# EAGLE design Stingray (EAGLE 6.5.0)
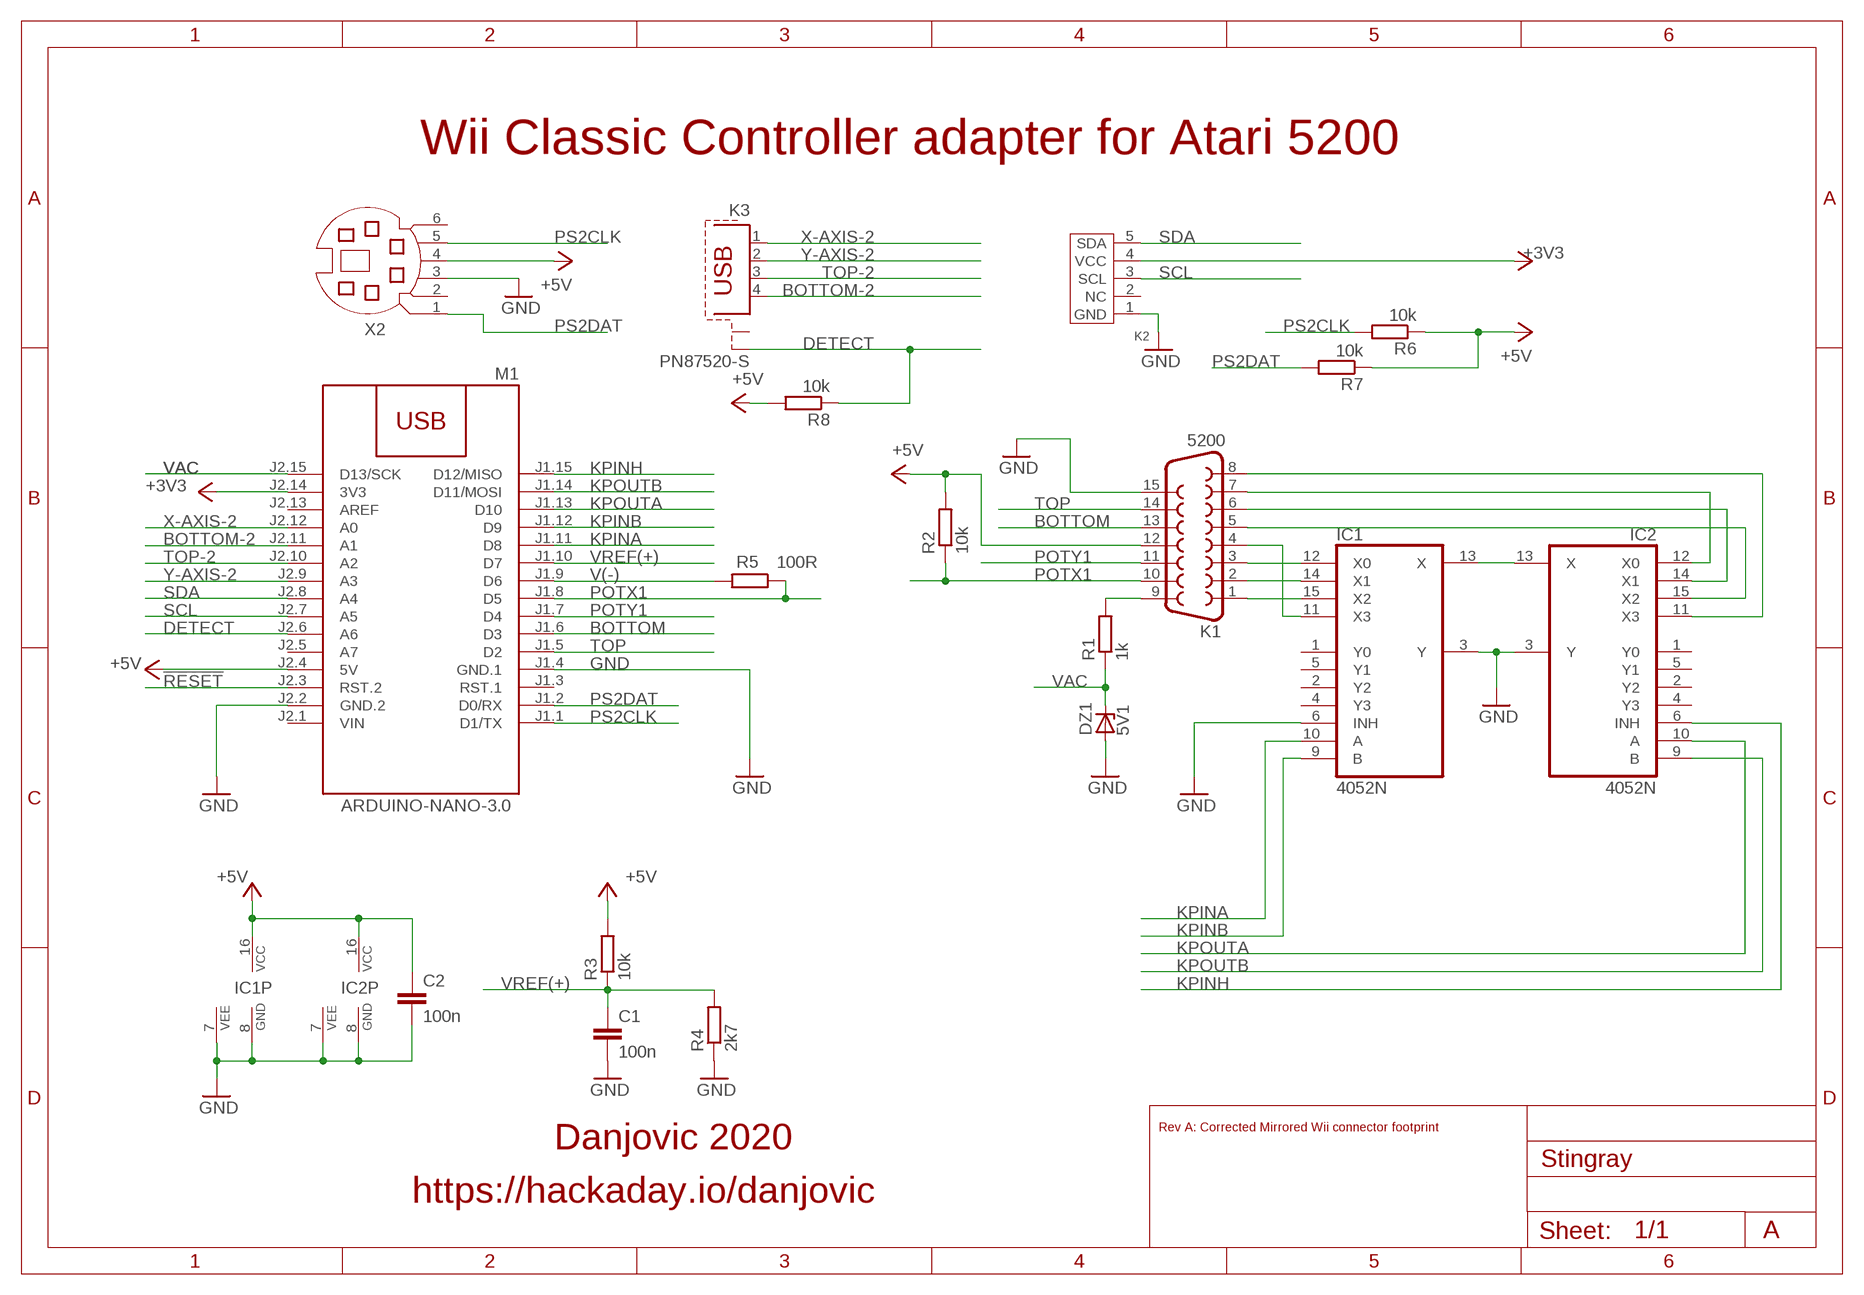
[diagram p0: schematic, sheet 1]

## Parts
C1  100n  C-EU050-024X044  [C050-024X044]
C2  100n  C-EU050-024X044  [C050-024X044]
DZ1  5V1  ZENER-DIODEZD-7.5  [ZDIO-7.5]
IC1  4052N  [DIL16]
IC2  4052N  [DIL16]
K1  5200  F15D  [F15D]
K2  WIICHUCK  [WIICHUCK]
K3  PN87520-S  [PN87520-S]
M1  ARDUINO-NANO-3.0  [ARDUINO-NANO-3.0]
R1  1k  R-EU_0204/7  [0204/7]
R2  10k  R-EU_0204/7  [0204/7]
R3  10k  R-EU_0204/7  [0204/7]
R4  2k7  R-EU_0204/7  [0204/7]
R5  100R  R-EU_0204/7  [0204/7]
R6  10k  R-EU_0204/7  [0204/7]
R7  10k  R-EU_0204/7  [0204/7]
R8  10k  R-EU_0204/7  [0204/7]
X2  MD06SS  [MDIN06SS]

## Nets
!RESET: M1.J2.3(RST.2)
+3V3: K2.4(VCC) M1.J2.14(3V3)
+5V: C2.1 IC1.16(VCC) IC2.16(VCC) K1.12 M1.J2.4(5V) R2.2 R3.2 R6.1 R7.1 R8.2 X2.4
BOTTOM: K1.13 M1.J1.6(D3)
BOTTOM-2: K3.4 M1.J2.11(A1)
COL0: IC2.12(X0) K1.7
COL1: IC2.14(X1) K1.6
COL2: IC2.15(X2) K1.5
COL3: IC2.11(X3) K1.8
DETECT: K3.S2 M1.J2.6(A6) R8.1
GND: C1.2 C2.2 DZ1.A IC1.3(Y) IC1.6(INH) IC1.7(VEE) IC1.8(GND) IC2.3(Y) IC2.7(VEE) IC2.8(GND) K1.15 K2.1(GND) M1.J1.4(GND.1) M1.J2.2(GND.2) R4.1 X2.3
KPINA: IC1.10(A) M1.J1.11(D8)
KPINB: IC1.9(B) M1.J1.12(D9)
KPINH: IC2.6(INH) M1.J1.15(D12/MISO)
KPOUTA: IC2.10(A) M1.J1.13(D10)
KPOUTB: IC2.9(B) M1.J1.14(D11/MOSI)
N$25: K1.9 R1.2
POTX1: K1.10 M1.J1.8(D5) R2.1 R5.1
POTY1: K1.11 M1.J1.7(D4)
PS2CLK: M1.J1.1(D1/TX) R6.2 X2.5
PS2DAT: M1.J1.2(D0/RX) R7.2 X2.1
ROW0: IC1.12(X0) K1.3
ROW1: IC1.14(X1) K1.2
ROW2: IC1.15(X2) K1.1
ROW3: IC1.11(X3) K1.4
SCL: K2.3(SCL) M1.J2.7(A5)
SDA: K2.5(SDA) M1.J2.8(A4)
TOP: K1.14 M1.J1.5(D2)
TOP-2: K3.3 M1.J2.10(A2)
V(-): M1.J1.9(D6) R5.2
VAC: DZ1.C M1.J2.15(D13/SCK) R1.1
VREF(+): C1.1 M1.J1.10(D7) R3.1 R4.2
X-AXIS-2: K3.1 M1.J2.12(A0)
XX: IC1.13(X) IC2.13(X)
Y-AXIS-2: K3.2 M1.J2.9(A3)
Unconnected: IC1.1(Y0) IC1.2(Y2) IC1.4(Y3) IC1.5(Y1) IC2.1(Y0) IC2.2(Y2) IC2.4(Y3) IC2.5(Y1) K2.2(NC) K3.S1 M1.J1.3(RST.1) M1.J2.5(A7) M1.J2.13(AREF) X2.2 X2.6

## Notes on the sheet
- Wii Classic Controller adapter for Atari 5200
- Rev A: Corrected Mirrored Wii connector footprint
- Danjovic 2020
- https://hackaday.io/danjovic
- A

## Power pins joined to a net without a drawn wire
VIN: M1.J2.1(VIN)

## Library data of the parts
C1 C2 = rcl:C-EU: CAPACITOR, European symbol
DZ1 = diode:ZENER-DIODE: Z-Diode
IC1 IC2 = 40xx:4052: Dual 4-channel ANALOG MULTIPLEXER
K1 = con-subd:F15: SUB-D; OC_FARNELL: unknown; OC_NEWARK: unknown
K2 = Grove - NunChuck  v1.0:WIICHUCK
K3 = con-berg:PN87520-S; OC_FARNELL: unknown; OC_NEWARK: unknown
M1 = diy-modules:ARDUINO-NANO-3.0: Arduino Nano 3.0 and compatible devices More details available here: https://www.arduino.cc/en/Main/ArduinoBoardNano Click here to find device on ebay.com <http://www.ebay.com/sch/arduino+nano>
R1-R8 = rcl:R-EU_: RESISTOR, European symbol
X2 = con-yamaichi:MD06SS: YAMAICHI CONNECTOR; OC_FARNELL: unknown; OC_NEWARK: unknown

## Board
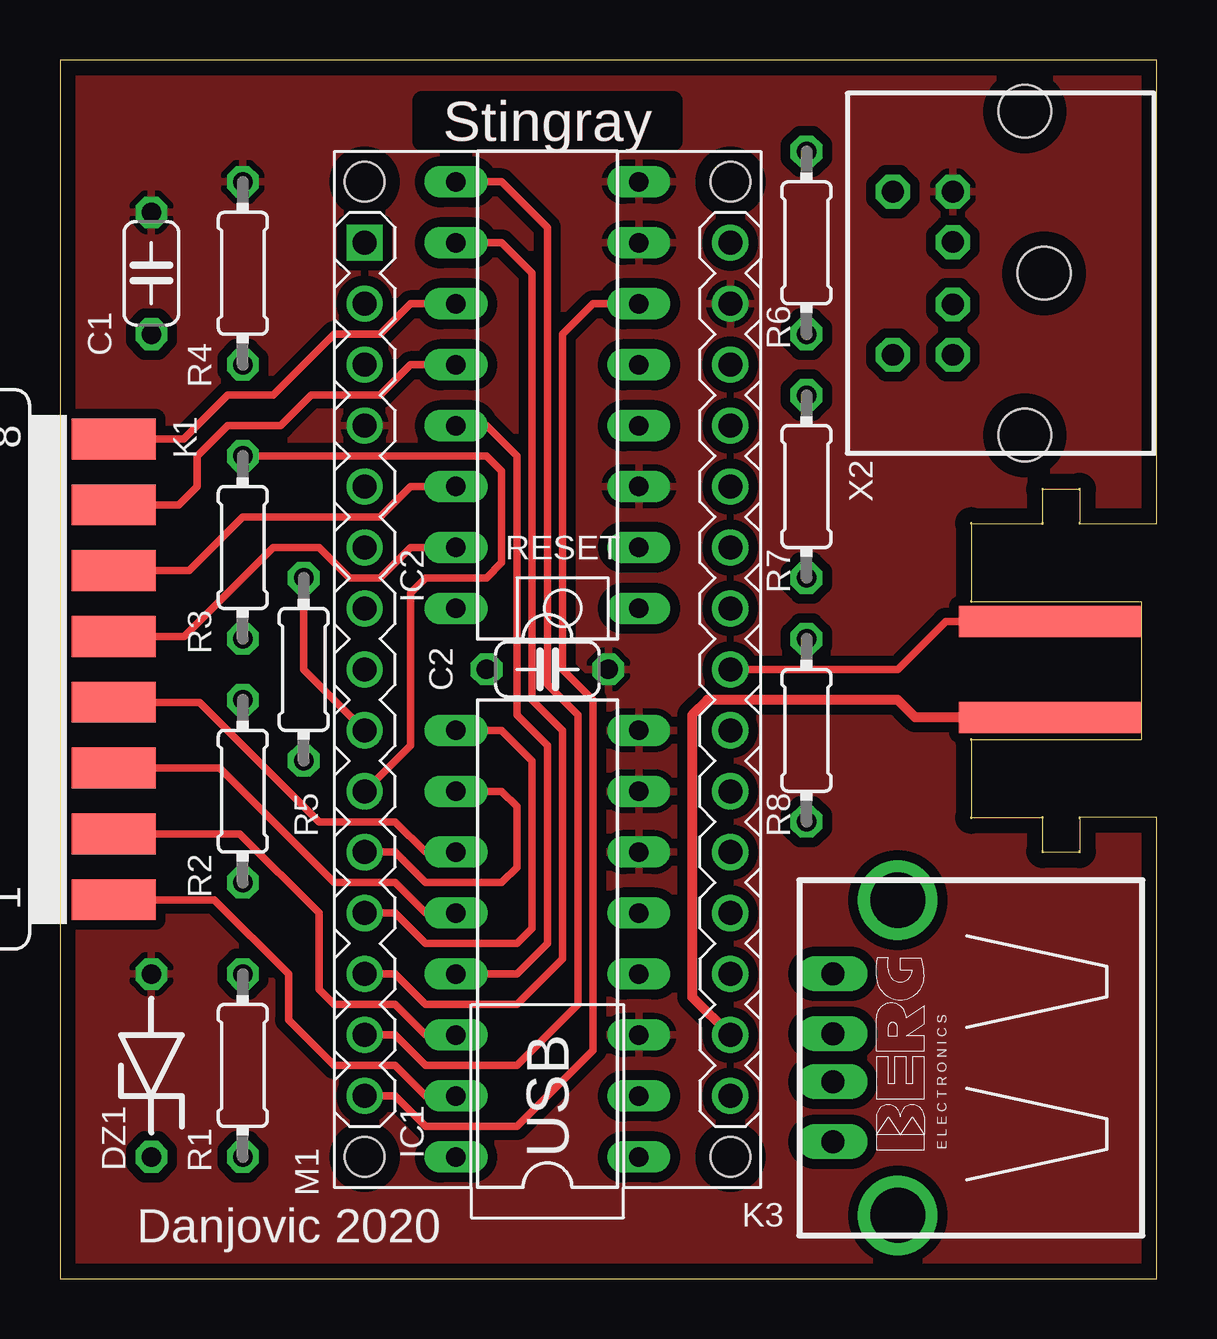
[diagram p1: board, top side]
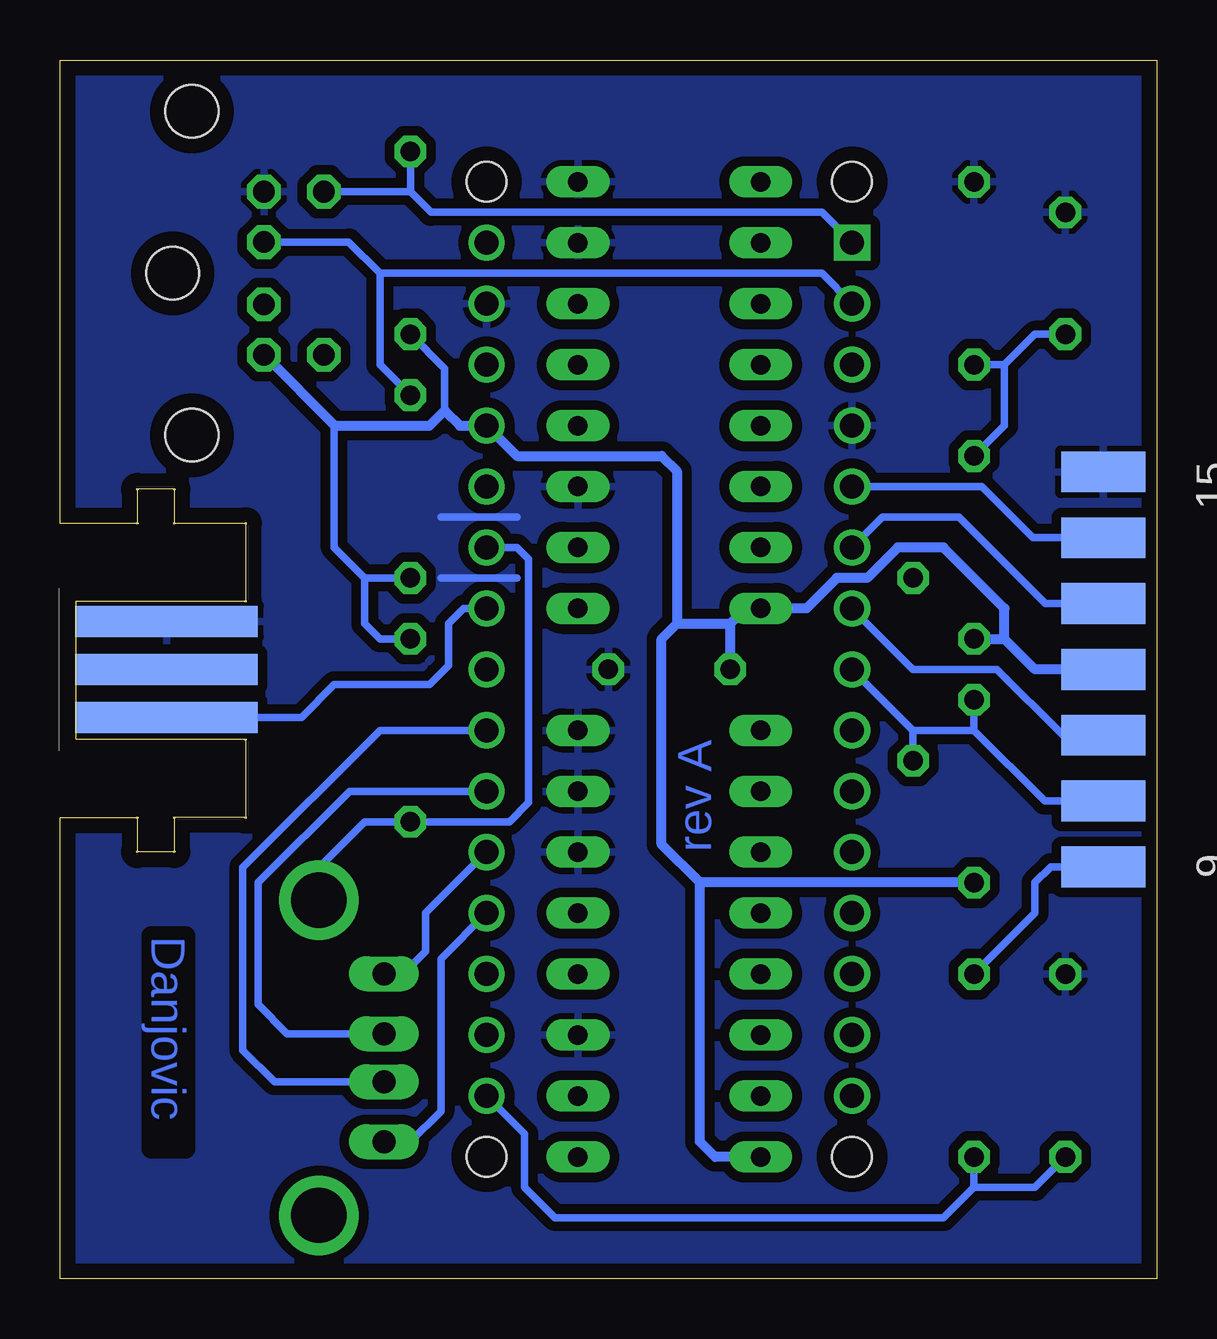
[diagram p2: board, bottom side, seen from below]

Size 45.72 x 50.8 mm. Coordinates in mm from the lower left corner, seen from the top.
Outline: 40.96,32.88 40.96,32.91 42.5,32.91 42.5,32.88
Outline: 40.96,32.88 40.96,31.52
Outline: 40.96,31.52 40.96,31.49 37.99,31.49 37.99,31.45
Outline: 40.96,31.45 arc180 40.96,31.52
Outline: 40.96,31.52 arc180 40.96,31.45
Outline: 40.96,32.88 arc180 40.96,32.94
Outline: 40.96,32.94 arc180 40.96,32.88
Outline: 42.5,32.88 arc180 42.5,32.94
Outline: 42.5,32.94 arc180 42.5,32.88
Outline: 40.96,32.88 arc180 40.96,32.94
Outline: 40.96,32.94 arc180 40.96,32.88
Outline: 42.5,32.88 42.5,31.52
Outline: 42.5,31.52 42.5,31.49 45.72,31.49 45.72,50.8 0,50.8 0,0 45.72,0 45.72,19.22 42.5,19.22 42.5,19.18
Outline: 42.5,31.46 arc180 42.5,31.52
Outline: 42.5,31.52 arc180 42.5,31.46
Outline: 42.5,32.88 arc180 42.5,32.94
Outline: 42.5,32.94 arc180 42.5,32.88
Outline: 42.5,31.46 arc180 42.5,31.52
Outline: 42.5,31.52 arc180 42.5,31.46
Outline: 40.96,31.45 arc180 40.96,31.52
Outline: 40.96,31.52 arc180 40.96,31.45
Outline: 37.99,31.45 arc180 37.99,31.52
Outline: 37.99,31.52 arc180 37.99,31.45
Outline: 37.99,31.45 37.99,28.27
Outline: 37.99,28.27 37.99,28.24 45.07,28.24 45.07,22.47 37.99,22.47 37.99,22.44
Outline: 37.99,28.2 arc180 37.99,28.27
Outline: 37.99,28.27 arc180 37.99,28.2
Outline: 37.99,31.45 arc180 37.99,31.52
Outline: 37.99,31.52 arc180 37.99,31.45
Outline: 37.99,28.2 arc180 37.99,28.27
Outline: 37.99,28.27 arc180 37.99,28.2
Outline: 40.96,19.19 40.96,19.22 37.99,19.22 37.99,19.25
Outline: 40.96,19.19 40.96,17.83
Outline: 40.96,17.83 40.96,17.8 42.5,17.8 42.5,17.83
Outline: 40.96,17.77 arc180 40.96,17.83
Outline: 40.96,17.83 arc180 40.96,17.77
Outline: 40.96,19.19 arc180 40.96,19.25
Outline: 40.96,19.25 arc180 40.96,19.19
Outline: 42.5,17.77 arc180 42.5,17.83
Outline: 42.5,17.83 arc180 42.5,17.77
Outline: 40.96,17.77 arc180 40.96,17.83
Outline: 40.96,17.83 arc180 40.96,17.77
Outline: 42.5,19.18 42.5,17.83
Outline: 42.5,17.77 arc180 42.5,17.83
Outline: 42.5,17.83 arc180 42.5,17.77
Outline: 42.5,19.18 arc180 42.5,19.25
Outline: 42.5,19.25 arc180 42.5,19.18
Outline: 42.5,19.18 arc180 42.5,19.25
Outline: 42.5,19.25 arc180 42.5,19.18
Outline: 40.96,19.19 arc180 40.96,19.25
Outline: 40.96,19.25 arc180 40.96,19.19
Outline: 37.99,19.19 arc180 37.99,19.25
Outline: 37.99,19.25 arc180 37.99,19.19
Outline: 37.99,22.44 37.99,19.25
Outline: 37.99,19.19 arc180 37.99,19.25
Outline: 37.99,19.25 arc180 37.99,19.19
Outline: 37.99,22.44 arc180 37.99,22.5
Outline: 37.99,22.5 arc180 37.99,22.44
Outline: 37.99,22.44 arc180 37.99,22.5
Outline: 37.99,22.5 arc180 37.99,22.44
Copper layers (1*16): Top 0.035mm / dielectric 1.5mm / Bottom 0.035mm
Design rules "default *": minimum track width 10mil, minimum drill 24mil, track to track 8mil, track to pad 8mil, pad to pad 8mil, via to via 8mil, smd to smd 8mil, copper to edge 25mil, drill to drill 8mil, minimum pad ring 10mil, minimum via ring 8mil, stop-mask expansion 4mil, vias tented up to drill 0mil, thermal gap 10mil

### Footprints (pad centres in the part's own frame; a part is rotated, then mirrored left to right if it is on the bottom)
C050-024X044 = drill 0.813 octagon: 1 -2.54,0; 2 2.54,0
ZDIO-7.5 = drill 0.813 octagon: A 3.81,0; C -3.81,0
DIL16 = drill 0.813 long: 1 -8.89,-3.81; 2 -6.35,-3.81; 3 -3.81,-3.81; 4 -1.27,-3.81; 5 1.27,-3.81; 6 3.81,-3.81; 7 6.35,-3.81; 8 8.89,-3.81; 9 8.89,3.81; 10 6.35,3.81; 11 3.81,3.81; 12 1.27,3.81; 13 -1.27,3.81; 14 -3.81,3.81; 15 -6.35,3.81; 16 -8.89,3.81
F15D = smd 1.7 x 3.5: 1 -9.601,-6.045; 2 -6.858,-6.045; 3 -4.115,-6.045; 4 -1.372,-6.045; 5 1.372,-6.045; 6 4.115,-6.045; 7 6.858,-6.045; 8 9.601,-6.045 | smd 1.7 x 3.5 bottom: 9 -8.23,-6.045; 10 -5.486,-6.045; 11 -2.743,-6.045; 12 0,-6.045; 13 2.743,-6.045; 14 5.486,-6.045; 15 8.23,-6.045
WIICHUCK = smd 7.6 x 1.3: 1 0,-2; 2 0,0; 3 0,2 | smd 7.6 x 1.3 bottom: 4 0,2; 5 0,-2
PN87520-S = drill 0.95 long: 1 -3.5,2.71; 2 -1,2.71; 3 1,2.71; 4 3.5,2.71 | drill 2.3 pad 2.9: S1 -6.57,0; S2 6.57,0
ARDUINO-NANO-3.0 = drill 1 square: J1.1 17.78,7.62 | drill 1: J1.2 15.24,7.62; J1.3 12.7,7.62; J1.4 10.16,7.62; J1.5 7.62,7.62; J1.6 5.08,7.62; J1.7 2.54,7.62; J1.8 0,7.62; J1.9 -2.54,7.62; J1.10 -5.08,7.62; J1.11 -7.62,7.62; J1.12 -10.16,7.62; J1.13 -12.7,7.62; J1.14 -15.24,7.62; J1.15 -17.78,7.62; J2.1 17.78,-7.62; J2.2 15.24,-7.62; J2.3 12.7,-7.62; J2.4 10.16,-7.62; J2.5 7.62,-7.62; J2.6 5.08,-7.62; J2.7 2.54,-7.62; J2.8 0,-7.62; J2.9 -2.54,-7.62; J2.10 -5.08,-7.62; J2.11 -7.62,-7.62; J2.12 -10.16,-7.62; J2.13 -12.7,-7.62; J2.14 -15.24,-7.62; J2.15 -17.78,-7.62 | hole 1.651: -20.32,7.62; -20.32,-7.62; 20.32,-7.62; 20.32,7.62
0204/7 = drill 0.813 octagon: 1 -3.81,0; 2 3.81,0
MDIN06SS = drill 0.9 octagon: 1 1.3,8.5; 2 -1.3,8.5; 3 3.4,8.5; 4 -3.4,8.5; 5 3.4,11; 6 -3.4,11 | hole 2.2: -6.75,5.5; 0,4.7; 6.75,5.5

### Placement (x,y rotation side)
C1  3.81,41.91 90 top
C2  20.32,25.4 0 top
DZ1  3.81,8.89 90 top
IC1  20.32,13.97 90 top
IC2  20.32,36.83 90 top
K1  -3.81,25.4 90 top
K2  41.27,25.4 180 bottom
K3  34.92,9.21 90 top
M1  20.32,25.4 90 top
R1  7.62,8.89 90 top
R2  7.62,20.32 270 top
R3  7.62,30.48 270 top
R4  7.62,41.91 270 top
R5  10.16,25.4 90 top
R6  31.11,43.18 90 top
R7  31.11,33.02 90 top
R8  31.11,22.86 90 top
X2  45.72,41.91 90 top

### Tracks (layer width: path | path; a pad name or v marks a point on that pad's centre or on a via)
+3V3
  Top 0.406: K2.4 35.66,23.4 34.92,24.13 26.99,24.13 26.35,23.49 26.35,11.75 M1.J2.14
+5V
  Bottom 0.305: R8.2 32.38,26.67 33.02,27.3 33.02,29.21 | 34.27,35.56 34.29,35.54 34.29,30.48 33.02,29.21 | R7.1 33.02,29.21 | R6.1 29.69,37.94 29.69,36.2
  Bottom 0.406: K1.12 5.08,25.4 6.35,26.67 | 6.35,26.67 6.35,27.94 8.89,30.48 10.79,30.48 12.06,29.21 13.34,29.21 14.61,27.94 IC2.16 17.14,27.94 17.78,27.3 | R3.2 6.35,26.67 | C2.1 17.78,27.3 | IC1.16 18.41,5.08 19.05,5.71 19.05,16.51 | 19.05,16.51 20.64,18.1 20.64,26.67 20,27.3 | 20,27.3 17.78,27.3 | R2.2 19.05,16.51 | 20,27.3 20,33.66 20.64,34.29 26.67,34.29 M1.J2.4 29.05,35.56 29.69,36.2 30.32,35.56 34.27,35.56 X2.4
BOTTOM
  Bottom 0.305: K1.13 4.65,28.14 6.99,30.48 8.26,31.75 11.43,31.75 M1.J1.6
BOTTOM-2
  Bottom 0.305: M1.J2.11 30.48,15.24 30.48,13.65 31.43,12.71 K3.4
COL0
  Top 0.305: K1.7 4.95,32.26 5.71,33.02 5.71,34.29 6.99,35.56 9.21,35.56 10.48,36.83 13.34,36.83 14.61,38.1 IC2.12
COL1
  Top 0.305: IC2.14 14.61,33.02 13.34,31.75 7.62,31.75 5.38,29.52 K1.6
COL2
  Top 0.305: K1.5 5.18,26.77 8.89,30.48 10.79,30.48 12.06,29.21 13.34,29.21 14.61,30.48 IC2.15
COL3
  Top 0.305: K1.8 5.16,35 6.99,36.83 8.89,36.83 11.43,39.37 13.34,39.37 14.61,40.64 IC2.11
DETECT
  Bottom 0.305: M1.J2.6 26.67,30.48 26.19,30 26.19,19.84 26.99,19.05 R8.1 33.02,19.05 34.92,17.14 K3.S2
GND
  Bottom 0.305: 26.67,31.75 29.84,31.75 | 26.67,29.21 29.84,29.21
  pour Bottom (isolate 0.406): 0,0 0,50.8 45.72,50.8 45.72,0
  pour Top (isolate 0.406): 0,0 0,50.8 45.72,50.8 45.72,0
KPINA
  Top 0.305: M1.J1.11 13.97,17.78 15.24,16.51 18.41,16.51 19.05,17.14 19.05,19.68 18.41,20.32 IC1.10
KPINB
  Top 0.305: M1.J1.12 13.97,15.24 15.24,13.97 19.05,13.97 19.68,14.61 19.68,21.59 18.41,22.86 IC1.9
KPINH
  Top 0.305: M1.J1.15 13.97,7.62 15.24,6.35 19.05,6.35 22.23,9.53 22.23,24.13 20.95,25.4 20.95,39.37 22.23,40.64 IC2.6
KPOUTA
  Top 0.305: IC2.10 18.41,43.18 19.68,41.91 19.68,24.13 20.95,22.86 20.95,13.34 19.05,11.43 15.24,11.43 13.97,12.7 M1.J1.13
KPOUTB
  Top 0.305: M1.J1.14 13.97,10.16 15.24,8.89 19.05,8.89 21.59,11.43 21.59,23.49 20.32,24.77 20.32,43.81 18.41,45.72 IC2.9
N$25
  Bottom 0.305: K1.9 4.42,17.17 5.08,16.51 5.08,15.24 R1.2
POTX1
  Bottom 0.305: 7.62,22.86 R2.1 | M1.J1.8 10.16,22.86 | 10.16,22.86 7.62,22.86 | R5.1 10.16,22.86 | K1.10 4.67,19.91 7.62,22.86
POTY1
  Bottom 0.305: K1.11 3.92,22.66 6.67,25.4 10.16,25.4 M1.J1.7
PS2CLK
  Bottom 0.305: M1.J1.1 13.97,44.45 30.25,44.45 31.11,45.31 | R6.2 31.11,45.31 | 31.11,45.31 X2.5
PS2DAT
  Bottom 0.305: M1.J1.2 13.97,41.91 32.38,41.91 | R7.2 32.38,38.1 32.38,41.91 | X2.1 33.69,43.21 32.38,41.91
ROW0
  Top 0.305: IC1.12 15.24,15.24 13.97,16.51 11.43,16.51 6.66,21.29 K1.3
ROW1
  Top 0.305: IC1.14 15.24,10.16 13.97,11.43 11.43,11.43 10.79,12.07 10.79,15.24 7.49,18.54 K1.2
ROW2
  Top 0.305: IC1.15 15.24,7.62 13.97,8.89 11.43,8.89 9.53,10.8 9.53,12.7 6.43,15.8 3.25,15.8
  Top 0.406: K1.1 3.25,15.8
ROW3
  Top 0.305: IC1.11 15.24,17.78 13.97,19.05 10.79,19.05 5.82,24.03 K1.4
SCL
  Bottom 0.305: K2.3 35.66,23.4 34.29,24.77 30.32,24.77 29.53,25.56 29.53,27.3 28.89,27.94 M1.J2.7
SDA
  Top 0.305: K2.5 36.92,27.4 34.92,25.4 M1.J2.8
TOP
  Bottom 0.305: K1.14 5.17,30.89 7.3,33.02 M1.J1.5
TOP-2
  Bottom 0.305: K3.3 36.24,10.21 37.47,11.43 37.47,16.51 33.66,20.32 M1.J2.10
V(-)
  Top 0.305: R5.2 10.16,25.4 M1.J1.9
VAC
  Bottom 0.305: 7.62,3.81 5.08,3.81 DZ1.C | 7.62,3.81 8.89,2.54 25.08,2.54 26.35,3.81 26.35,6.03 M1.J2.15 | R1.1 7.62,3.81
VREF(+)
  Top 0.305: R3.1 17.78,34.29 18.41,33.66 18.41,29.84 17.78,29.21 15.24,29.21 14.61,28.57 14.61,22.22 M1.J1.10
  Bottom 0.305: C1.1 5.08,39.37 6.35,38.1 | 6.35,38.1 6.35,35.56 R3.1 | R4.2 6.35,38.1
X-AXIS-2
  Bottom 0.305: M1.J2.12 29.84,13.34 29.84,6.99 31.12,5.71 K3.1
XX
  Top 0.305: IC1.13 19.05,12.7 20.32,13.97 20.32,22.22 19.05,23.49 19.05,34.29 17.78,35.56 IC2.13
Y-AXIS-2
  Bottom 0.305: M1.J2.9 32.38,22.86 38.1,17.14 38.1,9.53 36.78,8.21 K3.2

### Text on the board
Top: Stingray
Bottom: rev A | Danjovic
tPlace: Stingray | Danjovic 2020